# EAGLE schematic simple-hat (EAGLE 6.6.0)
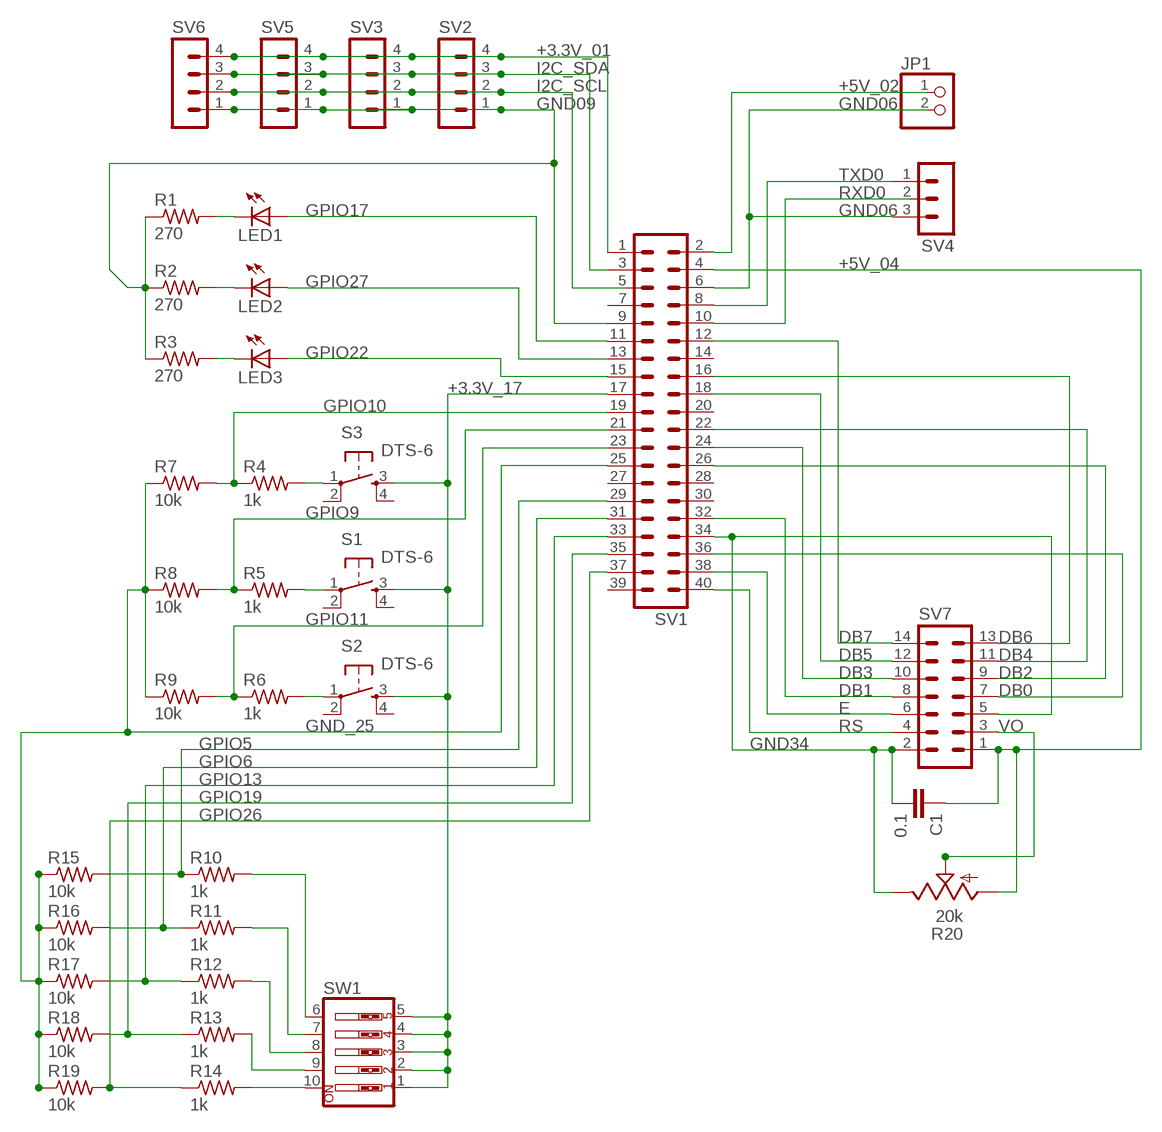
[diagram p0: schematic, sheet 1]

## Parts
C1  0.1  C-EU050-025X075  [C050-025X075]
JP1  PINHD-1X2  [1X02]
LED1  LED3MM  [LED3MM]
LED2  LED3MM  [LED3MM]
LED3  LED3MM  [LED3MM]
R1  270  R-US_0207/7  [0207/7]
R2  270  R-US_0207/7  [0207/7]
R3  270  R-US_0207/7  [0207/7]
R4  1k  R-US_0207/7  [0207/7]
R5  1k  R-US_0207/7  [0207/7]
R6  1k  R-US_0207/7  [0207/7]
R7  10k  R-US_0207/7  [0207/7]
R8  10k  R-US_0207/7  [0207/7]
R9  10k  R-US_0207/7  [0207/7]
R10  1k  R-US_0207/7  [0207/7]
R11  1k  R-US_0207/7  [0207/7]
R12  1k  R-US_0207/7  [0207/7]
R13  1k  R-US_0207/7  [0207/7]
R14  1k  R-US_0207/7  [0207/7]
R15  10k  R-US_0207/7  [0207/7]
R16  10k  R-US_0207/7  [0207/7]
R17  10k  R-US_0207/7  [0207/7]
R18  10k  R-US_0207/7  [0207/7]
R19  10k  R-US_0207/7  [0207/7]
R20  20k  TRIM_US-B25P  [B25P]
S1  DTS-6  [DTS-6]
S2  DTS-6  [DTS-6]
S3  DTS-6  [DTS-6]
SV1  MA20-2  [MA20-2]
SV2  MA04-1  [MA04-1]
SV3  MA04-1  [MA04-1]
SV4  MA03-1  [MA03-1]
SV5  MA04-1  [MA04-1]
SV6  MA04-1  [MA04-1]
SV7  MA07-2  [MA07-2]
SW1  SW_DIP-5  [EDG-05]

## Nets
+3.3V_01: SV1.1 SV2.4 SV3.4 SV5.4 SV6.4
+3.3V_17: S1.3 S2.3 S3.3 SV1.17 SW1.1 SW1.2 SW1.3 SW1.4 SW1.5
+5V_02: JP1.1 SV1.2
+5V_04: C1.1 R20.A SV1.4 SV7.1
DB0: SV1.36 SV7.7
DB1: SV1.32 SV7.8
DB2: SV1.26 SV7.9
DB3: SV1.24 SV7.10
DB4: SV1.22 SV7.11
DB5: SV1.18 SV7.12
DB6: SV1.16 SV7.13
DB7: SV1.12 SV7.14
E: SV1.38 SV7.6
GND06: JP1.2 SV1.6 SV4.3
GND09: R1.1 R2.1 R3.1 SV1.9 SV2.1 SV3.1 SV5.1 SV6.1
GND34: C1.2 R20.E SV1.34 SV7.2 SV7.5
GND_25: R7.1 R8.1 R9.1 R15.1 R16.1 R17.1 R18.1 R19.1 SV1.25
GPIO5: R10.1 R15.2 SV1.29
GPIO6: R11.1 R16.2 SV1.31
GPIO9: R5.1 R8.2 SV1.21
GPIO10: R4.1 R7.2 SV1.19
GPIO11: R6.1 R9.2 SV1.23
GPIO13: R12.1 R17.2 SV1.33
GPIO17: LED1.A SV1.11
GPIO19: R13.1 R18.2 SV1.35
GPIO22: LED3.A SV1.15
GPIO26: R14.1 R19.2 SV1.37
GPIO27: LED2.A SV1.13
I2C_SCL: SV2.2 SV3.2 SV5.2 SV6.2
I2C_SDA: SV1.3 SV2.3 SV3.3 SV5.3 SV6.3
N$1: LED1.K(C) R1.2
N$2: LED2.K(C) R2.2
N$3: LED3.K(C) R3.2
N$8: R4.2 S3.1
N$9: R5.2 S1.1
N$10: R6.2 S2.1
N$13: R11.2 SW1.7
N$14: R12.2 SW1.8
N$15: R10.2 SW1.6
N$18: R13.2 SW1.9
N$19: R14.2 SW1.10
RS: SV1.40 SV7.4
RXD0: SV1.10
TXD0: SV1.8 SV4.1
VO: R20.S SV7.3
Unconnected: S1.2 S1.4 S2.2 S2.4 S3.2 S3.4 SV1.5 SV1.7 SV1.14 SV1.20 SV1.27 SV1.28 SV1.30 SV1.39 SV4.2

## Library data of the parts
C1 = resistor:C-EU: CAPACITOR, European symbol
JP1 = pinhead:PINHD-1X2: PIN HEADER
LED1-LED3 = led:LED: LED OSRAM: - CHIPLED LG R971, LG N971, LY N971, LG Q971, LY Q971, LO R971, LY R971 LH N974, LH R974 LS Q976, LO Q976, LY Q976 LO Q996 - Hyper CHIPLED LW Q18S LB Q993, LB Q99A, LB R99A - SideLED LS A670, LO A670, LY A670, LG A670, LP A670 LB A673, LV A673, LT A673, LW A673 LH A674 LY A675 LS A676, LA A676, LO A676, LY A676, LW A676 LS A679, LY A679, LG A679 - Hyper Micro SIDELED® LS Y876, LA Y876, LO Y876, LY Y876 LT Y87S - SmartLED LW L88C, LW L88S LB L89C, LB L89S, LG L890 LS L89K, LO L89K, LY L89K LS L896, LA L896, LO L896, LY L896 - TOPLED LS T670, LO T670, LY T670, LG T670, LP T670 LSG T670, LSP T670, LSY T670, LOP T670, LYG T670 LG T671, LOG T671, LSG T671 LB T673, LV T673, LT T673, LW T673 LH T674 LS T676, LA T676, LO T676, LY T676, LB T676, LH T676, LSB T676, LW T676 LB T67C, LV T67C, LT T67C, LS T67K, LO T67K, LY T67K, LW E67C LS E67B, LA E67B, LO E67B, LY E67B, LB E67C, LV E67C, LT E67C LW T67C LS T679, LY T679, LG T679 LS T770, LO T770, LY T770, LG T770, LP T770 LB T773, LV T773, LT T773, LW T773 LH T774 LS E675, LA E675, LY E675, LS T675 LS T776, LA T776, LO T776, LY T776, LB T776 LHGB T686 LT T68C, LB T68C - Hyper Mini TOPLED® LB M676 - Mini TOPLED Santana® LG M470 LS M47K, LO M47K, LY M47K Source: http://www.osram.convergy.de LUXEON: - LUMILED® LXK2-PW12-R00, LXK2-PW12-S00, LXK2-PW14-U00, LXK2-PW14-V00 LXK2-PM12-R00, LXK2-PM12-S00, LXK2-PM14-U00 LXK2-PE12-Q00, LXK2-PE12-R00, LXK2-PE12-S00, LXK2-PE14-T00, LXK2-PE14-U00 LXK2-PB12-K00, LXK2-PB12-L00, LXK2-PB12-M00, LXK2-PB14-N00, LXK2-PB14-P00, LXK2-PB14-Q00 LXK2-PR12-L00, LXK2-PR12-M00, LXK2-PR14-Q00, LXK2-PR14-R00 LXK2-PD12-Q00, LXK2-PD12-R00, LXK2-PD12-S00 LXK2-PH12-R00, LXK2-PH12-S00 LXK2-PL12-P00, LXK2-PL12-Q00, LXK2-PL12-R00 Source: www.luxeon.com KINGBRIGHT: KA-3528ASYC Source: www.kingbright.com
R1-R19 = resistor:R-US_: RESISTOR, American symbol
R20 = pot:TRIM_US-: POTENTIOMETER
S1-S3 = switch-tact:DTS-6
SV1 = con-lstb:MA20-2: PIN HEADER; OC_FARNELL: unknown; OC_NEWARK: unknown
SV2 SV3 SV5 SV6 = con-lstb:MA04-1: PIN HEADER; OC_FARNELL: unknown; OC_NEWARK: unknown
SV4 = con-lstb:MA03-1: PIN HEADER; OC_FARNELL: unknown; OC_NEWARK: unknown
SV7 = con-lstb:MA07-2: PIN HEADER; OC_FARNELL: unknown; OC_NEWARK: unknown
SW1 = special:SW_DIP-5: DIP SWITCH